# EasyEDA Pro project ax08_doc.eprj, schematic ax08 main, sheets 1 to 4 of 16

## Sheets
1 register file: Board Name: ax08 main; Create Date: 2025-09-11; Page Name: register file; Project Name: ax08_doc; Schematic Name: ax08 main; Update Date: 2025-10-05; Company: EasyEDA.com; Page Size: A4; Version: V1.0
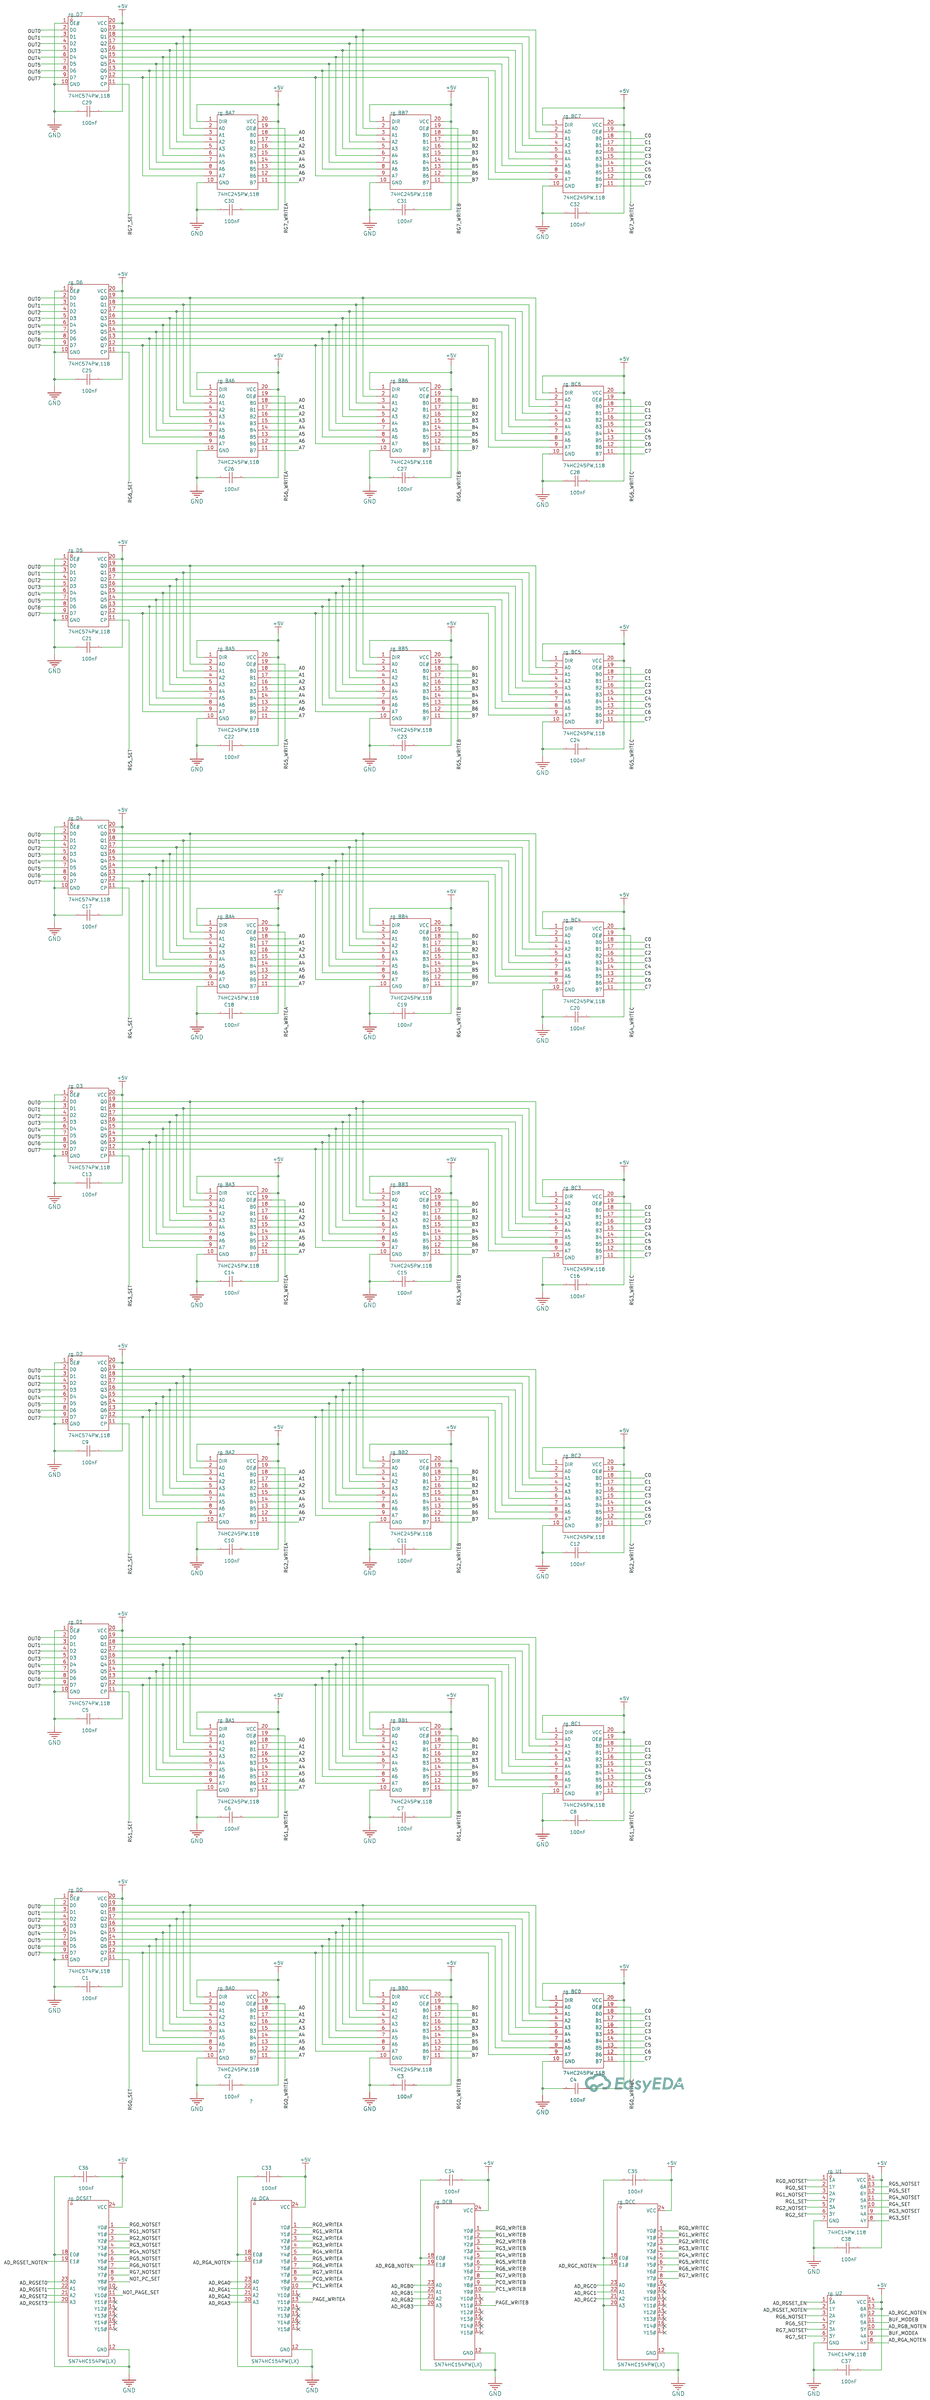
[diagram p5: register file]
2 program counter: Page Name: program counter; Update Date: 2025-09-11
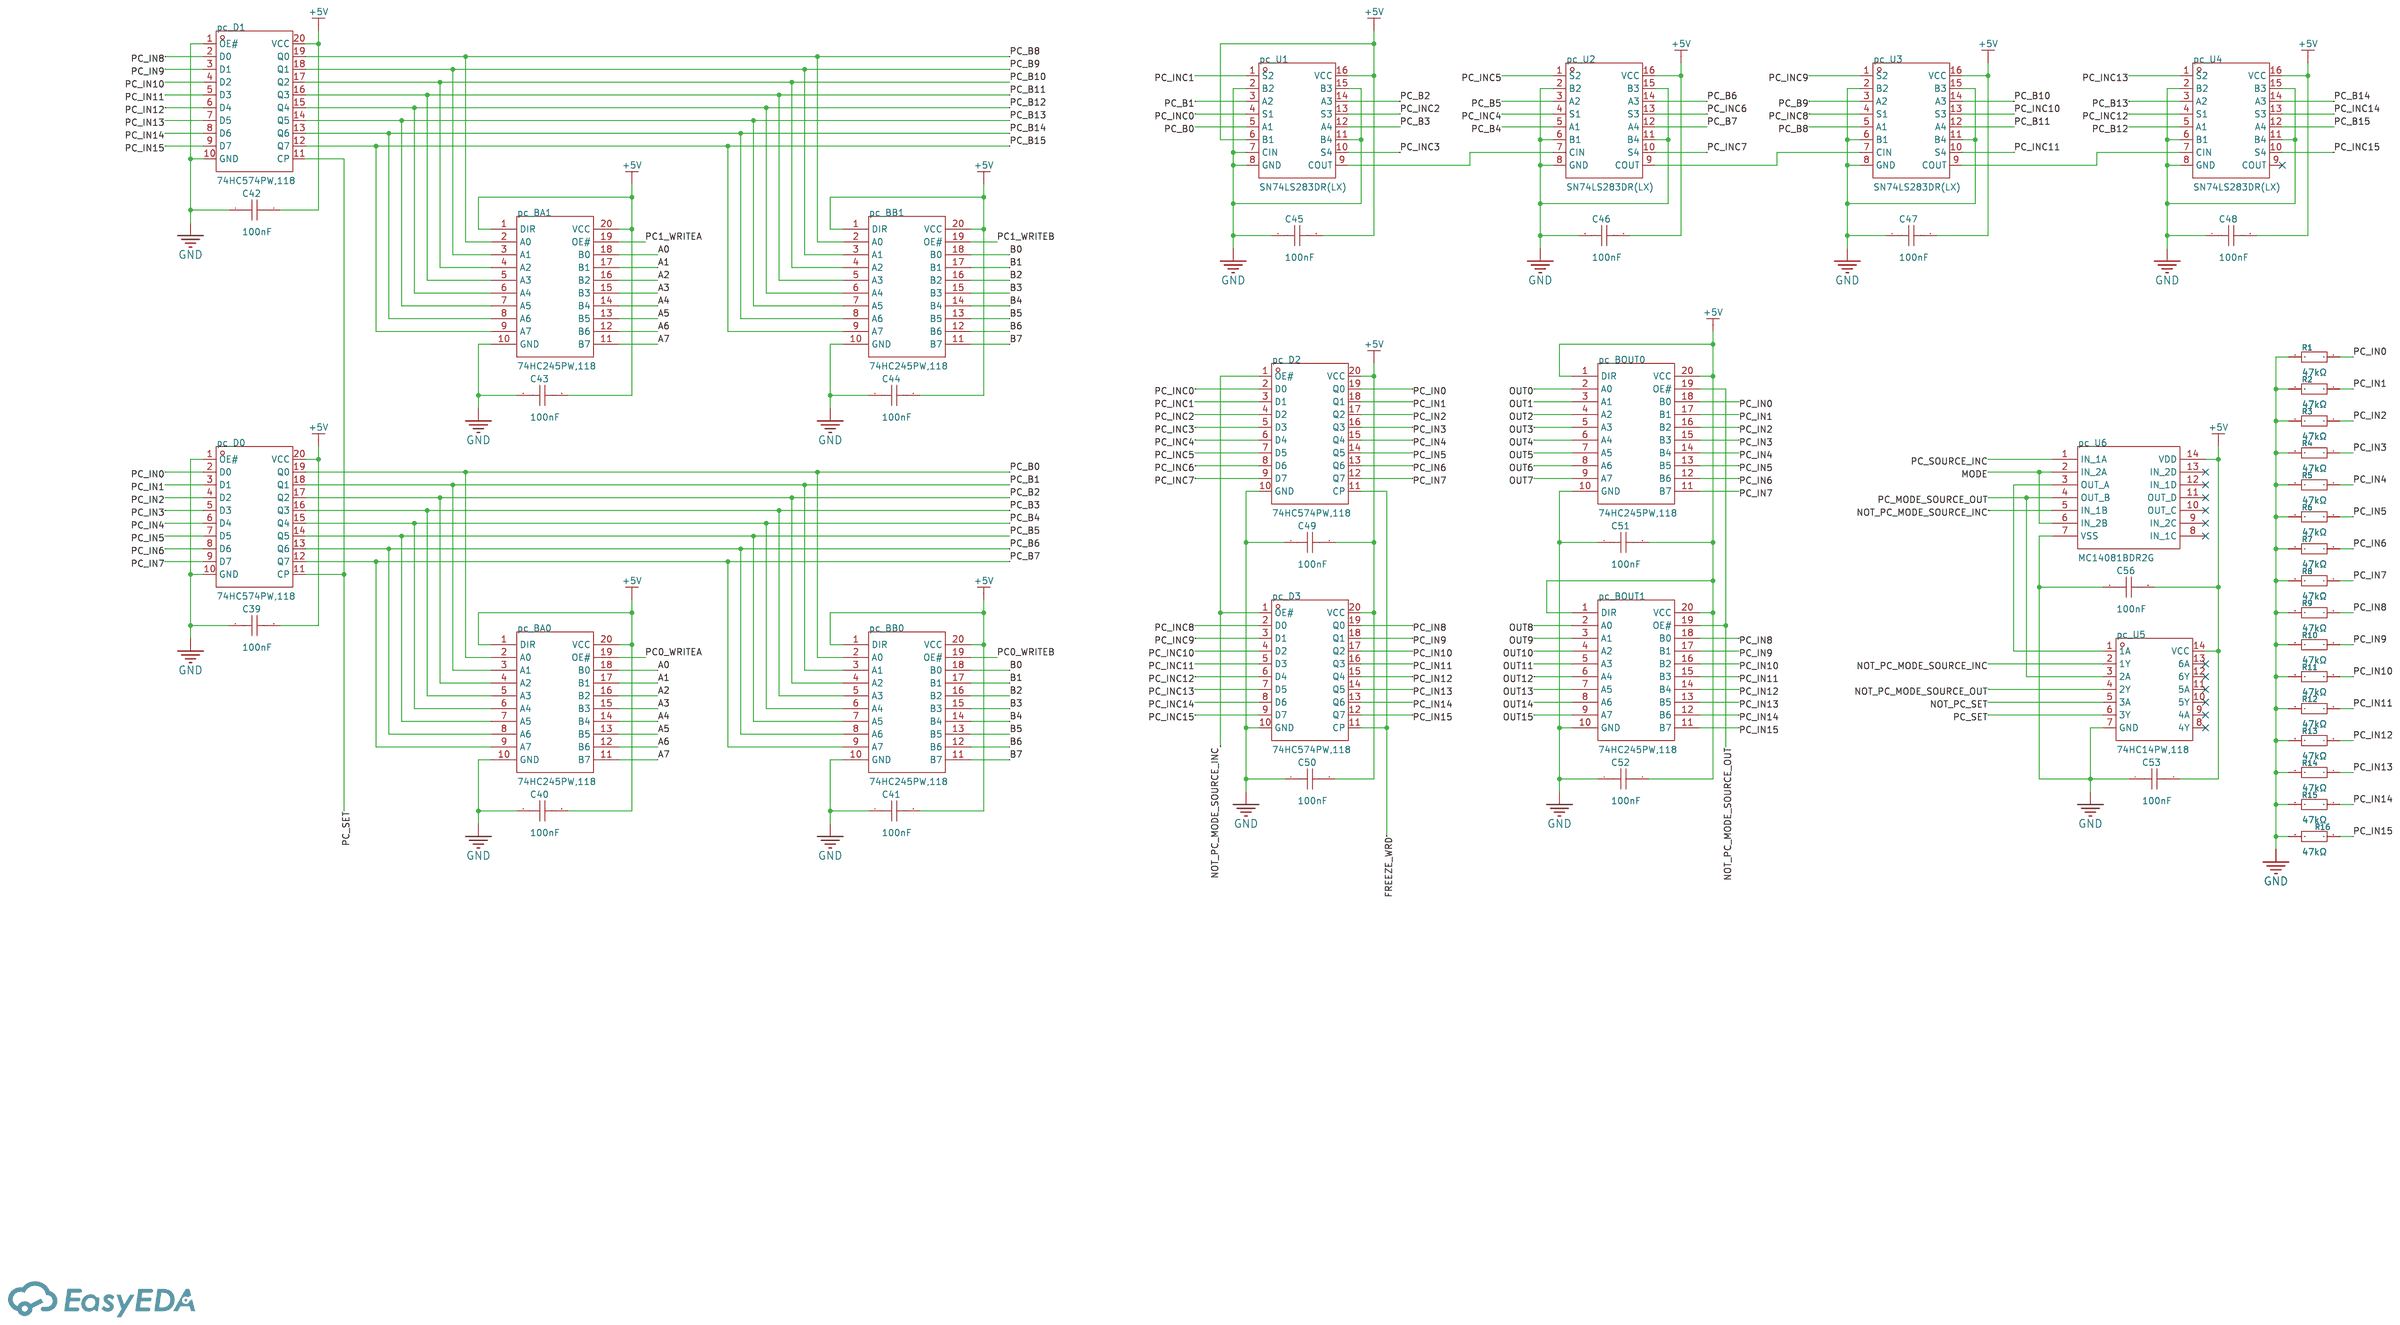
[diagram p6: program counter]
3 condition: Page Name: condition; Update Date: 2025-09-12
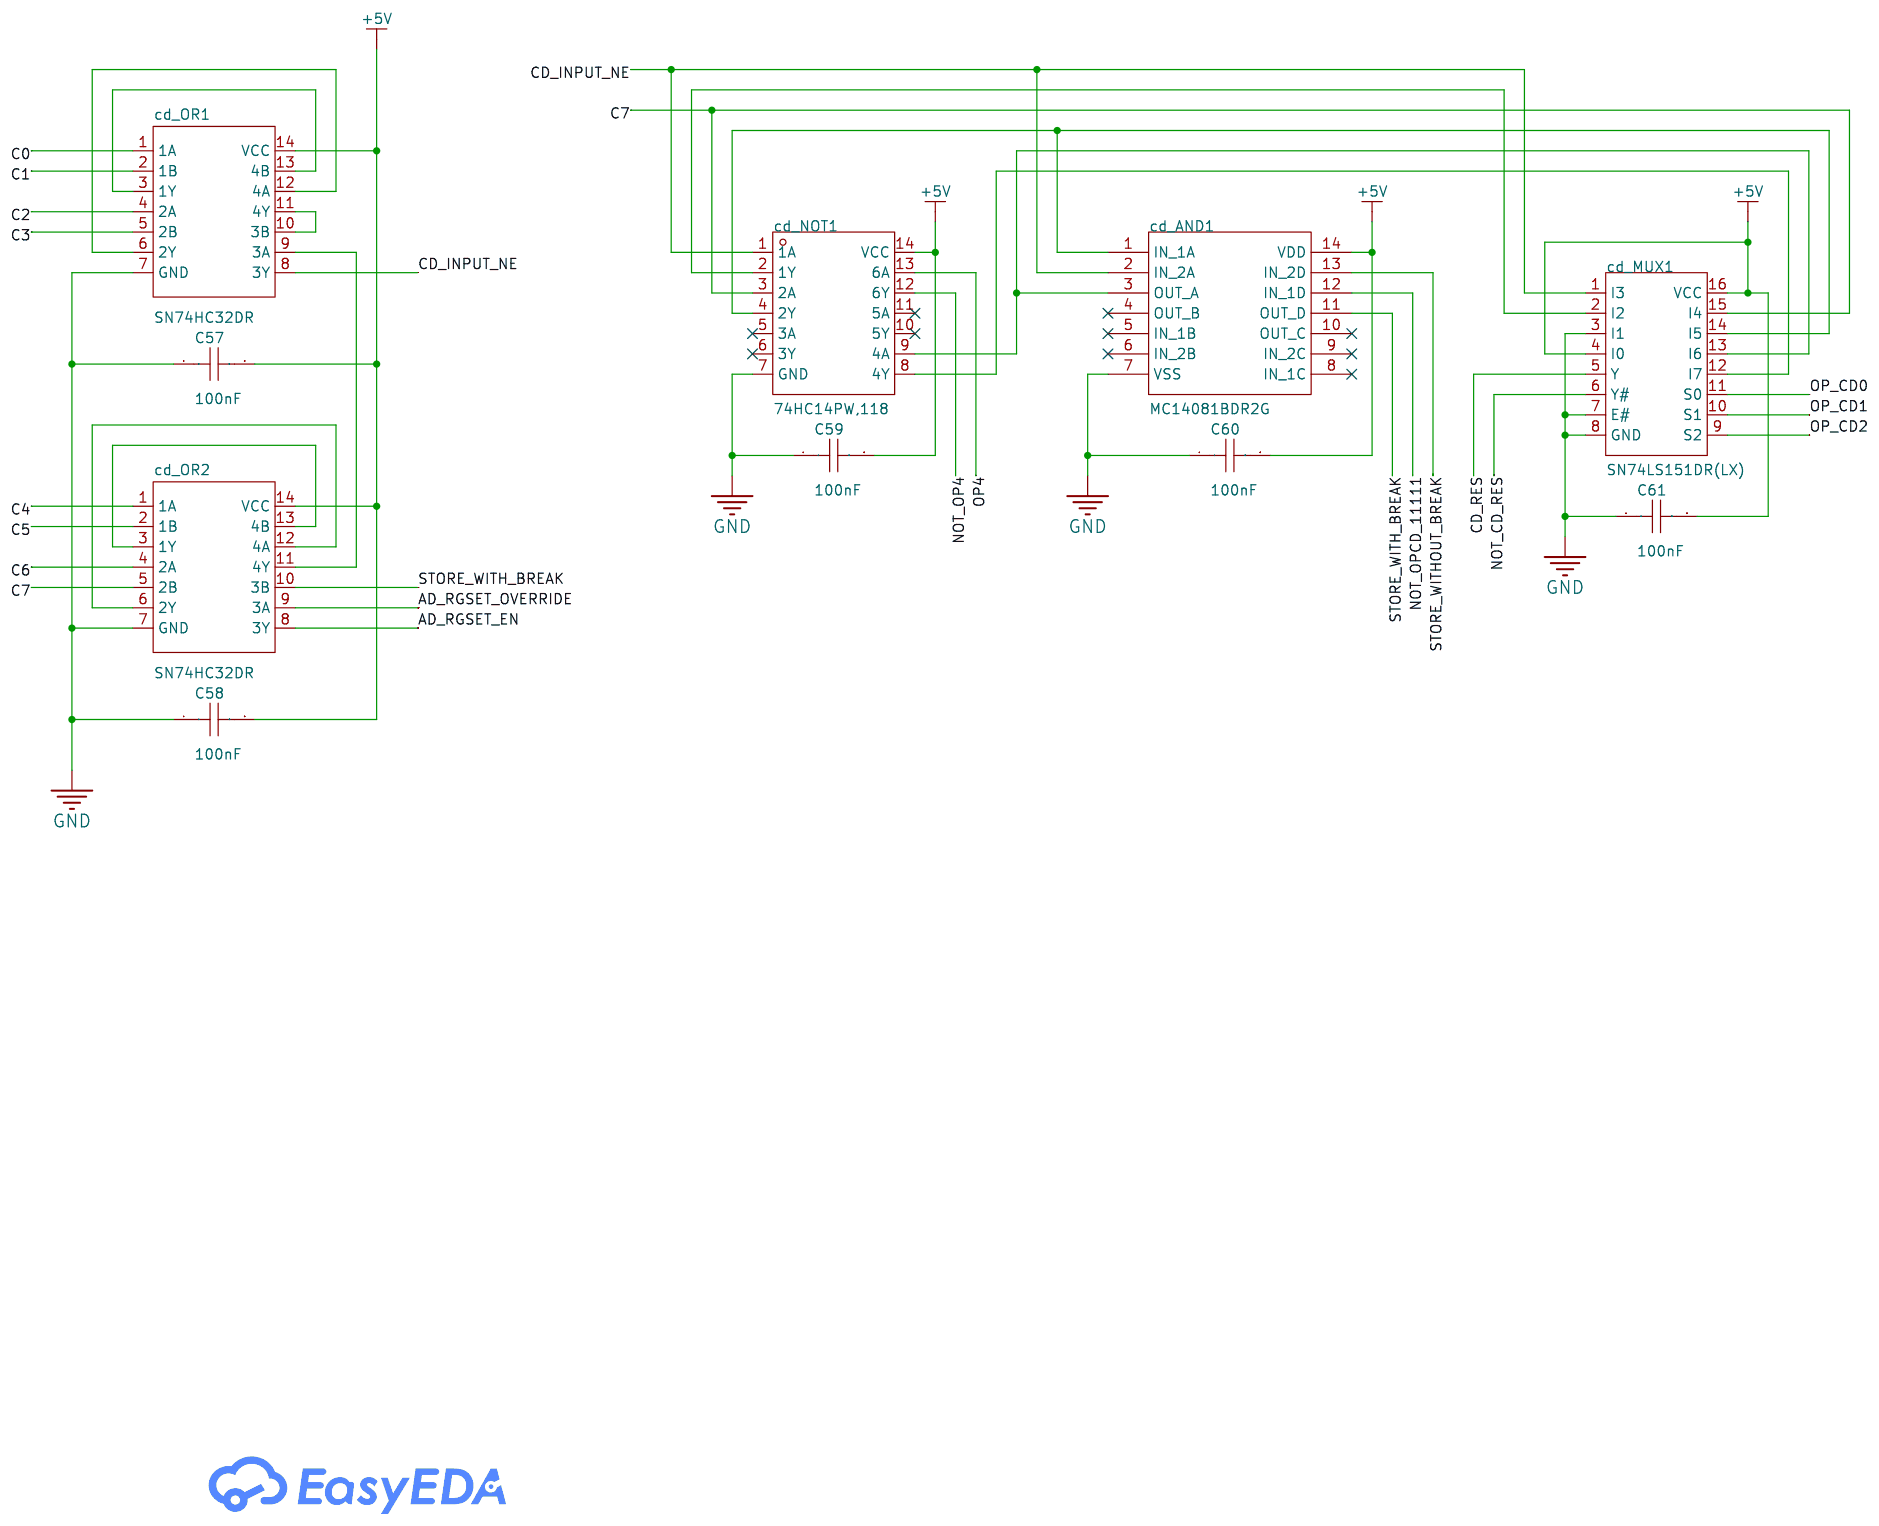
[diagram p7: condition]
4 page register: Page Name: page register; Update Date: 2025-09-11
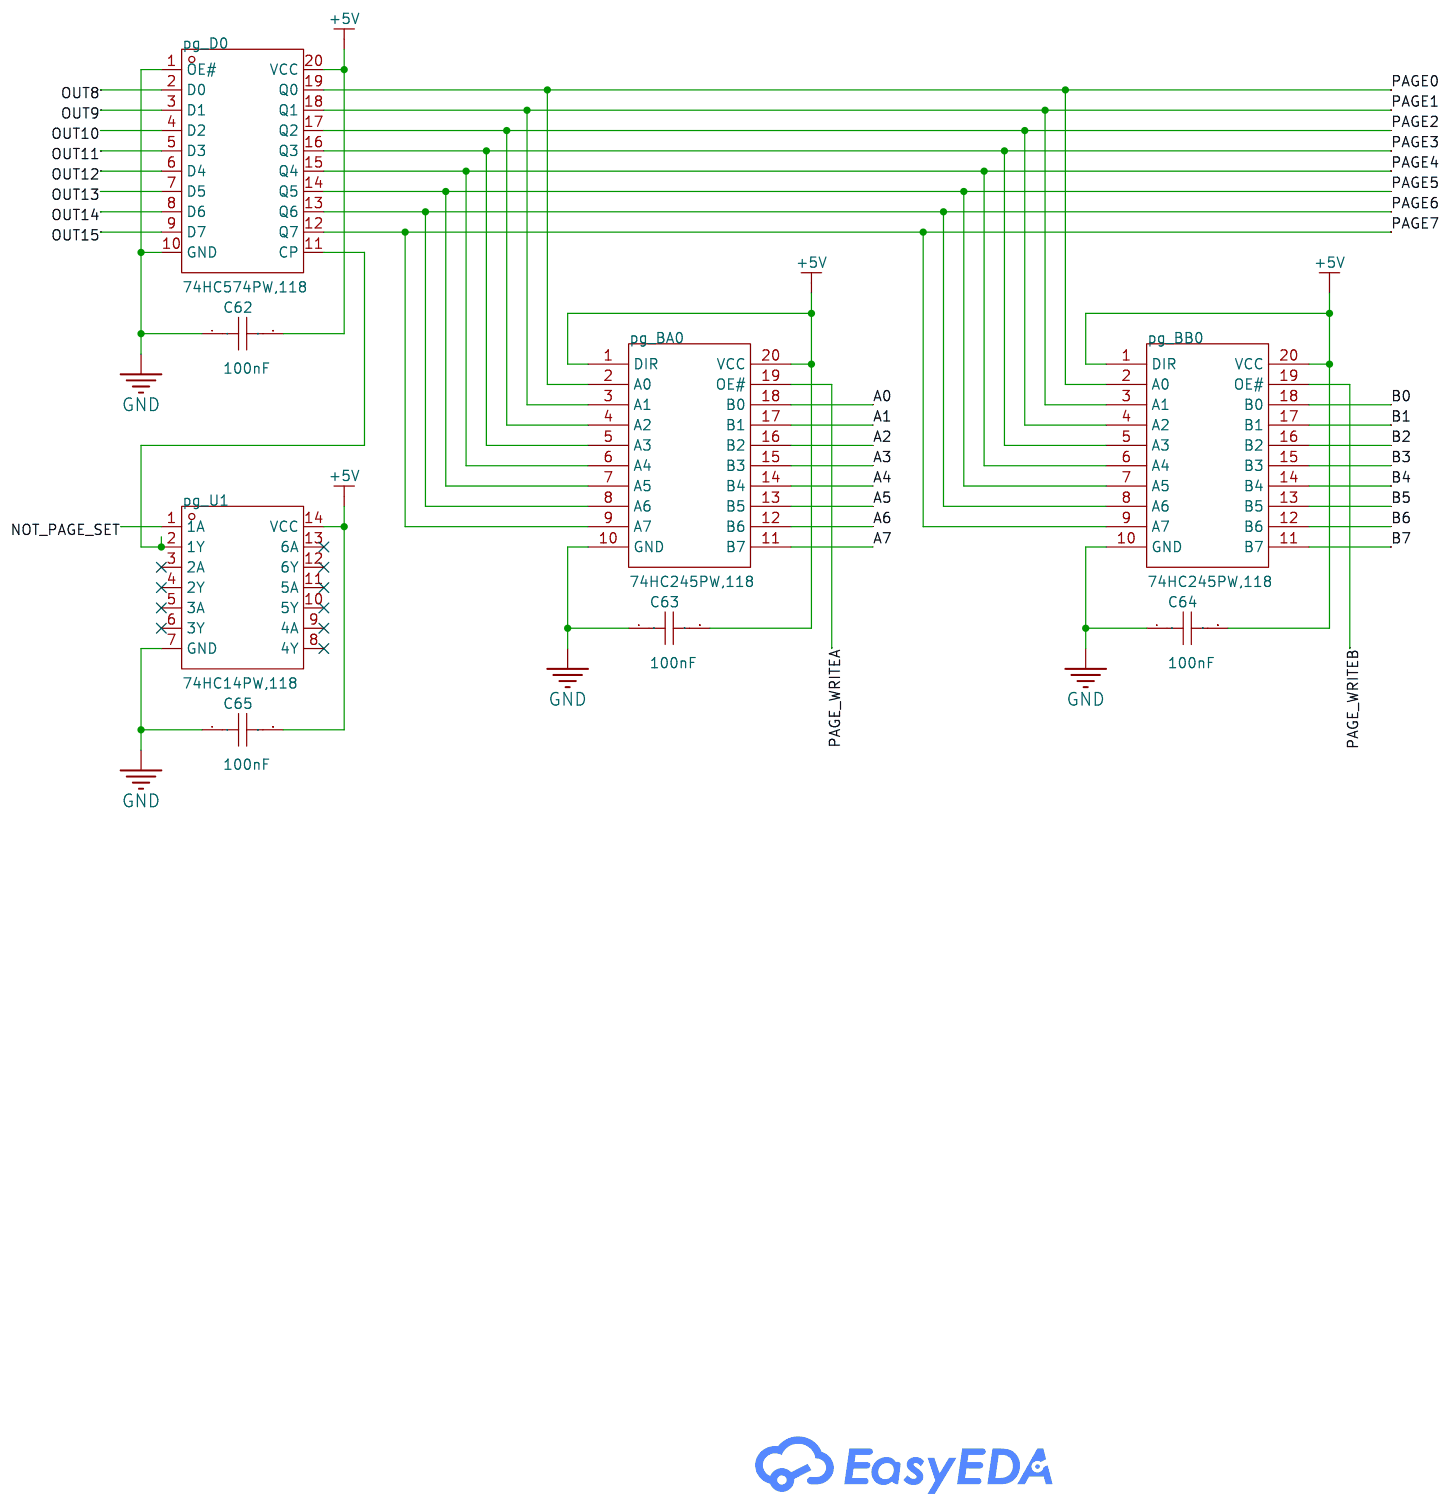
[diagram p8: page register]

## Parts
sheet condition
C57  100nF  [C0805]
C58  100nF  [C0805]
C59  100nF  [C0805]
C60  100nF  [C0805]
C61  100nF  [C0805]
cd_AND1  MC14081BDR2G  [SOIC-14_L8.7-W3.9-P1.27-LS6.0-BL]
cd_MUX1  SN74LS151DR(LX)  [SOP-16_L9.9-W3.9-P1.27-LS6.0-BL]
cd_NOT1  74HC14PW,118  [TSSOP-14_L5.0-W4.4-P0.65-LS6.4-BL]
cd_OR1  SN74HC32DR  [SOIC-14_L8.7-W3.9-P1.27-LS6.0-BL]
cd_OR2  SN74HC32DR  [SOIC-14_L8.7-W3.9-P1.27-LS6.0-BL]
sheet page register
C62  100nF  [C0805]
C63  100nF  [C0805]
C64  100nF  [C0805]
C65  100nF  [C0805]
pg_BA0  74HC245PW,118  [TSSOP-20_L6.5-W4.4-P0.65-LS6.4-BL]
pg_BB0  74HC245PW,118  [TSSOP-20_L6.5-W4.4-P0.65-LS6.4-BL]
pg_D0  74HC574PW,118  [TSSOP-20_L6.5-W4.4-P0.65-LS6.4-BL]
pg_U1  74HC14PW,118  [TSSOP-14_L5.0-W4.4-P0.65-LS6.4-BL]
sheet program counter
C39  100nF  [C0805]
C40  100nF  [C0805]
C41  100nF  [C0805]
C42  100nF  [C0805]
C43  100nF  [C0805]
C44  100nF  [C0805]
C45  100nF  [C0805]
C46  100nF  [C0805]
C47  100nF  [C0805]
C48  100nF  [C0805]
C49  100nF  [C0805]
C50  100nF  [C0805]
C51  100nF  [C0805]
C52  100nF  [C0805]
C53  100nF  [C0805]
C56  100nF  [C0805]
pc_BA0  74HC245PW,118  [TSSOP-20_L6.5-W4.4-P0.65-LS6.4-BL]
pc_BA1  74HC245PW,118  [TSSOP-20_L6.5-W4.4-P0.65-LS6.4-BL]
pc_BB0  74HC245PW,118  [TSSOP-20_L6.5-W4.4-P0.65-LS6.4-BL]
pc_BB1  74HC245PW,118  [TSSOP-20_L6.5-W4.4-P0.65-LS6.4-BL]
pc_BOUT0  74HC245PW,118  [TSSOP-20_L6.5-W4.4-P0.65-LS6.4-BL]
pc_BOUT1  74HC245PW,118  [TSSOP-20_L6.5-W4.4-P0.65-LS6.4-BL]
pc_D0  74HC574PW,118  [TSSOP-20_L6.5-W4.4-P0.65-LS6.4-BL]
pc_D1  74HC574PW,118  [TSSOP-20_L6.5-W4.4-P0.65-LS6.4-BL]
pc_D2  74HC574PW,118  [TSSOP-20_L6.5-W4.4-P0.65-LS6.4-BL]
pc_D3  74HC574PW,118  [TSSOP-20_L6.5-W4.4-P0.65-LS6.4-BL]
pc_U1  SN74LS283DR(LX)  [SOIC-16_L9.9-W3.9-P1.27-LS6.0-BL-1]
pc_U2  SN74LS283DR(LX)  [SOIC-16_L9.9-W3.9-P1.27-LS6.0-BL-1]
pc_U3  SN74LS283DR(LX)  [SOIC-16_L9.9-W3.9-P1.27-LS6.0-BL-1]
pc_U4  SN74LS283DR(LX)  [SOIC-16_L9.9-W3.9-P1.27-LS6.0-BL-1]
pc_U5  74HC14PW,118  [TSSOP-14_L5.0-W4.4-P0.65-LS6.4-BL]
pc_U6  MC14081BDR2G  [SOIC-14_L8.7-W3.9-P1.27-LS6.0-BL]
R1  47kΩ  [R0603]
R2  47kΩ  [R0603]
R3  47kΩ  [R0603]
R4  47kΩ  [R0603]
R5  47kΩ  [R0603]
R6  47kΩ  [R0603]
R7  47kΩ  [R0603]
R8  47kΩ  [R0603]
R9  47kΩ  [R0603]
R10  47kΩ  [R0603]
R11  47kΩ  [R0603]
R12  47kΩ  [R0603]
R13  47kΩ  [R0603]
R14  47kΩ  [R0603]
R15  47kΩ  [R0603]
R16  47kΩ  [R0603]
sheet register file
C1  100nF  [C0805]
C2  100nF  [C0805]
C3  100nF  [C0805]
C4  100nF  [C0805]
C5  100nF  [C0805]
C6  100nF  [C0805]
C7  100nF  [C0805]
C8  100nF  [C0805]
C9  100nF  [C0805]
C10  100nF  [C0805]
C11  100nF  [C0805]
C12  100nF  [C0805]
C13  100nF  [C0805]
C14  100nF  [C0805]
C15  100nF  [C0805]
C16  100nF  [C0805]
C17  100nF  [C0805]
C18  100nF  [C0805]
C19  100nF  [C0805]
C20  100nF  [C0805]
C21  100nF  [C0805]
C22  100nF  [C0805]
C23  100nF  [C0805]
C24  100nF  [C0805]
C25  100nF  [C0805]
C26  100nF  [C0805]
C27  100nF  [C0805]
C28  100nF  [C0805]
C29  100nF  [C0805]
C30  100nF  [C0805]
C31  100nF  [C0805]
C32  100nF  [C0805]
C33  100nF  [C0805]
C34  100nF  [C0805]
C35  100nF  [C0805]
C36  100nF  [C0805]
C37  100nF  [C0805]
C38  100nF  [C0805]
rg_BA0  74HC245PW,118  [TSSOP-20_L6.5-W4.4-P0.65-LS6.4-BL]
rg_BA1  74HC245PW,118  [TSSOP-20_L6.5-W4.4-P0.65-LS6.4-BL]
rg_BA2  74HC245PW,118  [TSSOP-20_L6.5-W4.4-P0.65-LS6.4-BL]
rg_BA3  74HC245PW,118  [TSSOP-20_L6.5-W4.4-P0.65-LS6.4-BL]
rg_BA4  74HC245PW,118  [TSSOP-20_L6.5-W4.4-P0.65-LS6.4-BL]
rg_BA5  74HC245PW,118  [TSSOP-20_L6.5-W4.4-P0.65-LS6.4-BL]
rg_BA6  74HC245PW,118  [TSSOP-20_L6.5-W4.4-P0.65-LS6.4-BL]
rg_BA7  74HC245PW,118  [TSSOP-20_L6.5-W4.4-P0.65-LS6.4-BL]
rg_BB0  74HC245PW,118  [TSSOP-20_L6.5-W4.4-P0.65-LS6.4-BL]
rg_BB1  74HC245PW,118  [TSSOP-20_L6.5-W4.4-P0.65-LS6.4-BL]
rg_BB2  74HC245PW,118  [TSSOP-20_L6.5-W4.4-P0.65-LS6.4-BL]
rg_BB3  74HC245PW,118  [TSSOP-20_L6.5-W4.4-P0.65-LS6.4-BL]
rg_BB4  74HC245PW,118  [TSSOP-20_L6.5-W4.4-P0.65-LS6.4-BL]
rg_BB5  74HC245PW,118  [TSSOP-20_L6.5-W4.4-P0.65-LS6.4-BL]
rg_BB6  74HC245PW,118  [TSSOP-20_L6.5-W4.4-P0.65-LS6.4-BL]
rg_BB7  74HC245PW,118  [TSSOP-20_L6.5-W4.4-P0.65-LS6.4-BL]
rg_BC0  74HC245PW,118  [TSSOP-20_L6.5-W4.4-P0.65-LS6.4-BL]
rg_BC1  74HC245PW,118  [TSSOP-20_L6.5-W4.4-P0.65-LS6.4-BL]
rg_BC2  74HC245PW,118  [TSSOP-20_L6.5-W4.4-P0.65-LS6.4-BL]
rg_BC3  74HC245PW,118  [TSSOP-20_L6.5-W4.4-P0.65-LS6.4-BL]
rg_BC4  74HC245PW,118  [TSSOP-20_L6.5-W4.4-P0.65-LS6.4-BL]
rg_BC5  74HC245PW,118  [TSSOP-20_L6.5-W4.4-P0.65-LS6.4-BL]
rg_BC6  74HC245PW,118  [TSSOP-20_L6.5-W4.4-P0.65-LS6.4-BL]
rg_BC7  74HC245PW,118  [TSSOP-20_L6.5-W4.4-P0.65-LS6.4-BL]
rg_D0  74HC574PW,118  [TSSOP-20_L6.5-W4.4-P0.65-LS6.4-BL]
rg_D1  74HC574PW,118  [TSSOP-20_L6.5-W4.4-P0.65-LS6.4-BL]
rg_D2  74HC574PW,118  [TSSOP-20_L6.5-W4.4-P0.65-LS6.4-BL]
rg_D3  74HC574PW,118  [TSSOP-20_L6.5-W4.4-P0.65-LS6.4-BL]
rg_D4  74HC574PW,118  [TSSOP-20_L6.5-W4.4-P0.65-LS6.4-BL]
rg_D5  74HC574PW,118  [TSSOP-20_L6.5-W4.4-P0.65-LS6.4-BL]
rg_D6  74HC574PW,118  [TSSOP-20_L6.5-W4.4-P0.65-LS6.4-BL]
rg_D7  74HC574PW,118  [TSSOP-20_L6.5-W4.4-P0.65-LS6.4-BL]
rg_DCA  SN74HC154PW(LX)  [TSSOP-24_L7.8-W4.4-P0.65-LS6.4-BL_1]
rg_DCB  SN74HC154PW(LX)  [TSSOP-24_L7.8-W4.4-P0.65-LS6.4-BL_1]
rg_DCC  SN74HC154PW(LX)  [TSSOP-24_L7.8-W4.4-P0.65-LS6.4-BL_1]
rg_DCSET  SN74HC154PW(LX)  [TSSOP-24_L7.8-W4.4-P0.65-LS6.4-BL_1]
rg_U1  74HC14PW,118  [TSSOP-14_L5.0-W4.4-P0.65-LS6.4-BL]
rg_U2  74HC14PW,118  [TSSOP-14_L5.0-W4.4-P0.65-LS6.4-BL]

## Library data of the parts
C57-C61 = CC0805KRX7R9BB104: LCSC Part Name: 100nF ±10% 50V; Supplier Part: C49678; Manufacturer: YAGEO(国巨); Supplier Footprint: 0805; JLCPCB Part Class: Basic Part; Datasheet: https://atta.szlcsc.com/upload/public/pdf/source/20180224/C181747_15194369449651363981.pdf; Supplier: LCSC; Tolerance: ±10%
cd_AND1 pc_U6 = MC14081BDR2G: Supplier Part: C52342; Manufacturer: onsemi(安森美); Supplier Footprint: SOIC-14; JLCPCB Part Class: Extended Part; Datasheet: https://atta.szlcsc.com/upload/public/pdf/source/20191203/C463300_6D19168778DBD465A86B239F140F6B23.pdf; Supplier: LCSC; Logic Gate Type: With Door; Number of Channels: 4; Supply Voltage: 3V~18V; Quiescent Current (Max): 1uA; Sink Current: 8.8mA; Source Current: 8.8mA; High Level Range (VIH): 3.5V~11V; Low Level Range (VIL): 1.5V~4V; Series: 4000BSeries; Propagation Delay Time: 100ns@15V,50pF; Operating Temperature: -55℃~+125℃
cd_MUX1 = SN74LS151DR(LX): LCSC Part Name: 集成电路; Supplier Part: C22384799; Manufacturer: LX(灵星芯微); Supplier Footprint: SOP-16; JLCPCB Part Class: Extended Part; Datasheet: https://atta.szlcsc.com/upload/public/pdf/source/20240417/7DDD5D0D7F70EA99A3E738629D06B469.pdf; Supplier: LCSC; Type: Multiplexers; Voltage Supply Source: Single supply; Voltage - Supply: 2V~6V; Current - Output Low(IOL): 5.2mA; Current - Output High(IOH): 5.2mA; Operating temperature: -40℃~+125℃
cd_NOT1 pc_U5 pg_U1 rg_U1 rg_U2 = 74HC14PW,118: Input Type:Schmitt Trigger Supply Voltage(Single):2V~6V Supply Voltage(Single):2V~6V Supply Current (Max):2uA Number of Circuits:6 Number of Inputs:1 Sink Current:5.2mA Source Current:5.2mA High level range (VIH):1.5V~4.2V High level range (VIH):1.5V~4.2V; LCSC Part Name: 六路施密特触发反相器; Supplier Part: C5606; Manufacturer: Nexperia(安世); Supplier Footprint: TSSOP-14; JLCPCB Part Class: Extended Part; Datasheet: https://atta.szlcsc.com/upload/public/pdf/source/20170918/C131315_1505726904049976307.pdf; Supplier: LCSC; Input Type: Schmitt Trigger; Supply Voltage(Single): 2V~6V; Supply Current (Max): 2uA; Number of Circuits: 6; Number of Inputs: 1; Sink Current: 5.2mA; Source Current: 5.2mA; High level range (VIH): 1.5V~4.2V; Low level range (VIL): 300mV~1.2V; Max Propagation Delay: 21ns@6V,50pF; Series: 74HCSeries; Operating Temperature: -40℃~+125℃
cd_OR1 cd_OR2 = SN74HC32DR: Supplier Part: C6838; Manufacturer: TI(德州仪器); Supplier Footprint: SOIC-14; JLCPCB Part Class: Extended Part; Datasheet: https://www.ti.com/cn/lit/gpn/sn74hc32; Supplier: LCSC; Logic Type: OR Gate; Number of Channels: 4; Voltage - Supply: 2V~6V; Quiescent Current: 2uA; Current - Output Low(IOL): 5.2mA; Current - Output High(IOH): 5.2mA; Input Logic Level - High: 1.5V~4.2V; Input Logic Level - Low: 500mV~1.8V; Series: 74HCSeries; Propagation Delay: 17ns@6V,50pF; Operating Temperature: -40℃~+85℃
C1-C53 C56 C62-C65 = CC0805KRX7R9BB104: Capacitance: Tolerance:±10% Tolerance:±10% Voltage Rated: Temperature Coefficient:; LCSC Part Name: 100nF ±10% 50V; Supplier Part: C49678; Manufacturer: YAGEO(国巨); Supplier Footprint: 0805; JLCPCB Part Class: Basic Part; Datasheet: https://atta.szlcsc.com/upload/public/pdf/source/20180224/C181747_15194369449651363981.pdf; Supplier: LCSC; Tolerance: ±10%
pc_BA0 pc_BA1 pc_BB0 pc_BB1 pc_BOUT0 pc_BOUT1 pg_BA0 pg_BB0 rg_BA0-rg_BA7 rg_BB0-rg_BB7 rg_BC0-rg_BC7 = 74HC245PW,118: Input type:- output type:Tri-State Supply Voltage:2V~6V Supply Voltage:2V~6V Number of Elements:1 Number of Bits per Element:8 Channel Type:- Sink Current:7.8mA Source Current:7.8mA Logic Family:74HC Operating Temperature:-40℃~+125℃ Operating Temperature:; Supplier Part: C5626; Manufacturer: Nexperia(安世); Supplier Footprint: TSSOP-20; JLCPCB Part Class: Extended Part; Datasheet: https://atta.szlcsc.com/upload/public/pdf/source/20240724/EDC8C45902BA97AEC59E8811E3964917.pdf; Supplier: LCSC; output type: Tri-State; Supply Voltage: 2V~6V; Number of Elements: 1; Number of Bits per Element: 8; Sink Current: 7.8mA; Source Current: 7.8mA; Logic Family: 74HC; Operating Temperature: -40℃~+125℃
pc_D0-pc_D3 pg_D0 rg_D0-rg_D7 = 74HC574PW,118: Type:D-Type Trigger Type:Rising Edge Supply Voltage:2V~6V Supply Voltage:2V~6V Clock Frequency:133MHz Function: Number of Elements:1 Number of Bits per Element:8 Output Type: Maximum Propagation Delay:26ns@6V,50pF Series:74HCSeries Sink Current:7.8mA Sour; Supplier Part: C93762; Manufacturer: Nexperia(安世); Supplier Footprint: TSSOP-20; JLCPCB Part Class: Extended Part; Datasheet: https://atta.szlcsc.com/upload/public/pdf/source/20230809/78F4E93A48B1813E6DF94573D4B43A3E.pdf; Supplier: LCSC; Type: D-Type; Trigger Type: Rising Edge; Supply Voltage: 2V~6V; Clock Frequency: 133MHz; Number of Elements: 1; Number of Bits per Element: 8; Maximum Propagation Delay: 26ns@6V,50pF; Series: 74HCSeries; Sink Current: 7.8mA; Source Current: 7.8mA; Quiescent Current (Iq): 8uA; Input Capacitance: 3.5pF; Operating Temperature: -40℃~+125℃
pc_U1-pc_U4 = SN74LS283DR(LX): Supplier Part: C22374103; Manufacturer: LX(灵星芯微); Supplier Footprint: SOP-16; JLCPCB Part Class: Extended Part; Datasheet: https://atta.szlcsc.com/upload/public/pdf/source/20240402/80BBEEF0EDCF1C8215BAA06339FE4235.pdf; Supplier: LCSC; Logic Type: Binary Full Adder; Number of Channels: 4; Supply Voltage: 2V~6V; Operating Temperature: -40℃~+125℃
R1-R16 = FRC0603F4702TS: Type:Thick Film Resistors Resistance:47kΩ Tolerance:±1% Tolerance:±1% Power(Watts): Overload Voltage (Max): Temperature Coefficient:±100ppm/℃ Temperature Coefficient:±100ppm/℃ Operating Temperature Range:-55℃~+155℃ Operating Temperature Range:-55℃~+155℃; LCSC Part Name: 47kΩ ±1% 100mW 厚膜电阻; Supplier Part: C2907042; Manufacturer: FOJAN(富捷); Supplier Footprint: 0603; JLCPCB Part Class: Extended Part; Datasheet: https://atta.szlcsc.com/upload/public/pdf/source/20211221/925EC7D7225764EE0046F22065062C87.pdf; Supplier: LCSC; Type: Thick Film Resistors; Tolerance: ±1%; Temperature Coefficient: ±100ppm/℃; Operating Temperature Range: -55℃~+155℃
rg_DCA rg_DCB rg_DCC rg_DCSET = SN74HC154PW(LX): Type:Decoder/Demultiplexers Voltage Supply Source:Single supply Supply Voltage:2V~6V Supply Voltage:2V~6V Number of lines:4~16 Number of lines:4~16 Sink Current:- Source Current:- Operating temperature:-40℃~+125℃ Operating temperature:-40℃~+125℃; Supplier Part: C41413100; Manufacturer: LX(灵星芯微); Supplier Footprint: TSSOP-24; JLCPCB Part Class: Extended Part; Datasheet: https://atta.szlcsc.com/upload/public/pdf/source/20240923/0BF8EBFBC2EE7843BBF2E86797CF806E.pdf; Supplier: LCSC; Type: Decoder/Demultiplexers; Voltage Supply Source: Single supply; Supply Voltage: 2V~6V; Number of lines: 4~16; Operating temperature: -40℃~+125℃

## Nets
+5V: C1.2 C2.2 C3.2 C4.2 C5.2 C6.2 C7.2 C8.2 C9.2 C10.2 C11.2 C12.2 C13.2 C14.2 C15.2 C16.2 C17.2 C18.2 C19.2 C20.2 C21.2 C22.2 C23.2 C24.2 C25.2 C26.2 C27.2 C28.2 C29.2 C30.2 C31.2 C32.2 C33.1 C34.1 C35.1 C36.1 C37.2 C38.2 C39.2 C40.2 C41.2 C42.2 C43.2 C44.2 C45.2 C46.2 C47.2 C48.2 C49.2 C50.2 C51.2 C52.2 C53.2 C56.2 C57.2 C58.2 C59.2 C60.2 C61.2 C62.2 C63.2 C64.2 C65.2 cd_AND1.14(VDD) cd_MUX1.4(I0) cd_MUX1.16(VCC) cd_NOT1.14(VCC) cd_OR1.14(VCC) cd_OR2.14(VCC) pc_BA0.1(DIR) pc_BA0.20(VCC) pc_BA1.1(DIR) pc_BA1.20(VCC) pc_BB0.1(DIR) pc_BB0.20(VCC) pc_BB1.1(DIR) pc_BB1.20(VCC) pc_BOUT0.1(DIR) pc_BOUT0.20(VCC) pc_BOUT1.1(DIR) pc_BOUT1.20(VCC) pc_D0.20(VCC) pc_D1.20(VCC) pc_D2.20(VCC) pc_D3.20(VCC) pc_U1.6(B1) pc_U1.16(VCC) pc_U2.16(VCC) pc_U3.16(VCC) pc_U4.16(VCC) pc_U5.14(VCC) pc_U6.14(VDD) pg_BA0.1(DIR) pg_BA0.20(VCC) pg_BB0.1(DIR) pg_BB0.20(VCC) pg_D0.20(VCC) pg_U1.14(VCC) rg_BA0.1(DIR) rg_BA0.20(VCC) rg_BA1.1(DIR) rg_BA1.20(VCC) rg_BA2.1(DIR) rg_BA2.20(VCC) rg_BA3.1(DIR) rg_BA3.20(VCC) rg_BA4.1(DIR) rg_BA4.20(VCC) rg_BA5.1(DIR) rg_BA5.20(VCC) rg_BA6.1(DIR) rg_BA6.20(VCC) rg_BA7.1(DIR) rg_BA7.20(VCC) rg_BB0.1(DIR) rg_BB0.20(VCC) rg_BB1.1(DIR) rg_BB1.20(VCC) rg_BB2.1(DIR) rg_BB2.20(VCC) rg_BB3.1(DIR) rg_BB3.20(VCC) rg_BB4.1(DIR) rg_BB4.20(VCC) rg_BB5.1(DIR) rg_BB5.20(VCC) rg_BB6.1(DIR) rg_BB6.20(VCC) rg_BB7.1(DIR) rg_BB7.20(VCC) rg_BC0.1(DIR) rg_BC0.20(VCC) rg_BC1.1(DIR) rg_BC1.20(VCC) rg_BC2.1(DIR) rg_BC2.20(VCC) rg_BC3.1(DIR) rg_BC3.20(VCC) rg_BC4.1(DIR) rg_BC4.20(VCC) rg_BC5.1(DIR) rg_BC5.20(VCC) rg_BC6.1(DIR) rg_BC6.20(VCC) rg_BC7.1(DIR) rg_BC7.20(VCC) rg_D0.20(VCC) rg_D1.20(VCC) rg_D2.20(VCC) rg_D3.20(VCC) rg_D4.20(VCC) rg_D5.20(VCC) rg_D6.20(VCC) rg_D7.20(VCC) rg_DCA.24(VCC) rg_DCB.24(VCC) rg_DCC.24(VCC) rg_DCSET.24(VCC) rg_U1.14(VCC) rg_U2.13(6A) rg_U2.14(VCC) ; also on sheet 5 6 7 8 9 10 11 12 13 14 15 16
GND: C1.1 C2.1 C3.1 C4.1 C5.1 C6.1 C7.1 C8.1 C9.1 C10.1 C11.1 C12.1 C13.1 C14.1 C15.1 C16.1 C17.1 C18.1 C19.1 C20.1 C21.1 C22.1 C23.1 C24.1 C25.1 C26.1 C27.1 C28.1 C29.1 C30.1 C31.1 C32.1 C33.2 C34.2 C35.2 C36.2 C37.1 C38.1 C39.1 C40.1 C41.1 C42.1 C43.1 C44.1 C45.1 C46.1 C47.1 C48.1 C49.1 C50.1 C51.1 C52.1 C53.1 C56.1 C57.1 C58.1 C59.1 C60.1 C61.1 C62.1 C63.1 C64.1 C65.1 cd_AND1.7(VSS) cd_MUX1.3(I1) cd_MUX1.7(E#) cd_MUX1.8(GND) cd_NOT1.7(GND) cd_OR1.7(GND) cd_OR2.7(GND) pc_BA0.10(GND) pc_BA1.10(GND) pc_BB0.10(GND) pc_BB1.10(GND) pc_BOUT0.10(GND) pc_BOUT1.10(GND) pc_D0.1(OE#) pc_D0.10(GND) pc_D1.1(OE#) pc_D1.10(GND) pc_D2.10(GND) pc_D3.10(GND) pc_U1.2(B2) pc_U1.7(CIN) pc_U1.8(GND) pc_U1.11(B4) pc_U1.15(B3) pc_U2.2(B2) pc_U2.6(B1) pc_U2.8(GND) pc_U2.11(B4) pc_U2.15(B3) pc_U3.2(B2) pc_U3.6(B1) pc_U3.8(GND) pc_U3.11(B4) pc_U3.15(B3) pc_U4.2(B2) pc_U4.6(B1) pc_U4.8(GND) pc_U4.11(B4) pc_U4.15(B3) pc_U5.7(GND) pc_U6.7(VSS) pg_BA0.10(GND) pg_BB0.10(GND) pg_D0.1(OE#) pg_D0.10(GND) pg_U1.7(GND) R1.2 R2.2 R3.2 R4.2 R5.2 R6.2 R7.2 R8.2 R9.2 R10.2 R11.2 R12.2 R13.2 R14.2 R15.2 R16.2 rg_BA0.10(GND) rg_BA1.10(GND) rg_BA2.10(GND) rg_BA3.10(GND) rg_BA4.10(GND) rg_BA5.10(GND) rg_BA6.10(GND) rg_BA7.10(GND) rg_BB0.10(GND) rg_BB1.10(GND) rg_BB2.10(GND) rg_BB3.10(GND) rg_BB4.10(GND) rg_BB5.10(GND) rg_BB6.10(GND) rg_BB7.10(GND) rg_BC0.10(GND) rg_BC1.10(GND) rg_BC2.10(GND) rg_BC3.10(GND) rg_BC4.10(GND) rg_BC5.10(GND) rg_BC6.10(GND) rg_BC7.10(GND) rg_D0.1(OE#) rg_D0.10(GND) rg_D1.1(OE#) rg_D1.10(GND) rg_D2.1(OE#) rg_D2.10(GND) rg_D3.1(OE#) rg_D3.10(GND) rg_D4.1(OE#) rg_D4.10(GND) rg_D5.1(OE#) rg_D5.10(GND) rg_D6.1(OE#) rg_D6.10(GND) rg_D7.1(OE#) rg_D7.10(GND) rg_DCA.12(GND) rg_DCA.18(E0#) rg_DCB.12(GND) rg_DCB.18(E0#) rg_DCC.12(GND) rg_DCC.18(E0#) rg_DCC.20(A3) rg_DCSET.12(GND) rg_DCSET.18(E0#) rg_U1.7(GND) rg_U2.7(GND) ; also on sheet 5 6 7 8 9 10 11 12 13 14 15 16
A0: pc_BA0.18(B0) pc_BA1.18(B0) pg_BA0.18(B0) rg_BA0.18(B0) rg_BA1.18(B0) rg_BA2.18(B0) rg_BA3.18(B0) rg_BA4.18(B0) rg_BA5.18(B0) rg_BA6.18(B0) rg_BA7.18(B0) ; also on sheet 5 10 11 12 13 14
A1: pc_BA0.17(B1) pc_BA1.17(B1) pg_BA0.17(B1) rg_BA0.17(B1) rg_BA1.17(B1) rg_BA2.17(B1) rg_BA3.17(B1) rg_BA4.17(B1) rg_BA5.17(B1) rg_BA6.17(B1) rg_BA7.17(B1) ; also on sheet 5 10 11 12 13 14
A2: pc_BA0.16(B2) pc_BA1.16(B2) pg_BA0.16(B2) rg_BA0.16(B2) rg_BA1.16(B2) rg_BA2.16(B2) rg_BA3.16(B2) rg_BA4.16(B2) rg_BA5.16(B2) rg_BA6.16(B2) rg_BA7.16(B2) ; also on sheet 5 10 11 12 13 14
A3: pc_BA0.15(B3) pc_BA1.15(B3) pg_BA0.15(B3) rg_BA0.15(B3) rg_BA1.15(B3) rg_BA2.15(B3) rg_BA3.15(B3) rg_BA4.15(B3) rg_BA5.15(B3) rg_BA6.15(B3) rg_BA7.15(B3) ; also on sheet 5 10 11 13 14
A4: pc_BA0.14(B4) pc_BA1.14(B4) pg_BA0.14(B4) rg_BA0.14(B4) rg_BA1.14(B4) rg_BA2.14(B4) rg_BA3.14(B4) rg_BA4.14(B4) rg_BA5.14(B4) rg_BA6.14(B4) rg_BA7.14(B4) ; also on sheet 5 10 11 13 14
A5: pc_BA0.13(B5) pc_BA1.13(B5) pg_BA0.13(B5) rg_BA0.13(B5) rg_BA1.13(B5) rg_BA2.13(B5) rg_BA3.13(B5) rg_BA4.13(B5) rg_BA5.13(B5) rg_BA6.13(B5) rg_BA7.13(B5) ; also on sheet 5 10 11 13 14
A6: pc_BA0.12(B6) pc_BA1.12(B6) pg_BA0.12(B6) rg_BA0.12(B6) rg_BA1.12(B6) rg_BA2.12(B6) rg_BA3.12(B6) rg_BA4.12(B6) rg_BA5.12(B6) rg_BA6.12(B6) rg_BA7.12(B6) ; also on sheet 5 10 11 13 14
A7: pc_BA0.11(B7) pc_BA1.11(B7) pg_BA0.11(B7) rg_BA0.11(B7) rg_BA1.11(B7) rg_BA2.11(B7) rg_BA3.11(B7) rg_BA4.11(B7) rg_BA5.11(B7) rg_BA6.11(B7) rg_BA7.11(B7) ; also on sheet 5 10 11 13 14
AD_RGA0: rg_DCA.23(A0) ; also on sheet 5
AD_RGA1: rg_DCA.22(A1) ; also on sheet 5
AD_RGA2: rg_DCA.21(A2) ; also on sheet 5
AD_RGA3: rg_DCA.20(A3) ; also on sheet 5
AD_RGA_NOTEN: rg_DCA.19(E1#) rg_U2.8(4Y)
AD_RGB0: rg_DCB.23(A0) ; also on sheet 5
AD_RGB1: rg_DCB.22(A1) ; also on sheet 5
AD_RGB2: rg_DCB.21(A2) ; also on sheet 5
AD_RGB3: rg_DCB.20(A3) ; also on sheet 5
AD_RGB_NOTEN: rg_DCB.19(E1#) rg_U2.10(5Y)
AD_RGC0: rg_DCC.23(A0) ; also on sheet 5
AD_RGC1: rg_DCC.22(A1) ; also on sheet 5
AD_RGC2: rg_DCC.21(A2) ; also on sheet 5
AD_RGC_NOTEN: rg_DCC.19(E1#) rg_U2.12(6Y)
AD_RGSET0: rg_DCSET.23(A0) ; also on sheet 5
AD_RGSET1: rg_DCSET.22(A1) ; also on sheet 5
AD_RGSET2: rg_DCSET.21(A2) ; also on sheet 5
AD_RGSET3: rg_DCSET.20(A3) ; also on sheet 5
AD_RGSET_EN: cd_OR2.8(3Y) rg_U2.1(1A)
AD_RGSET_NOTEN: rg_DCSET.19(E1#) rg_U2.2(1Y)
AD_RGSET_OVERRIDE: cd_OR2.9(3A) ; also on sheet 8 16
B0: pc_BB0.18(B0) pc_BB1.18(B0) pg_BB0.18(B0) rg_BB0.18(B0) rg_BB1.18(B0) rg_BB2.18(B0) rg_BB3.18(B0) rg_BB4.18(B0) rg_BB5.18(B0) rg_BB6.18(B0) rg_BB7.18(B0) ; also on sheet 5 11 13 14
B1: pc_BB0.17(B1) pc_BB1.17(B1) pg_BB0.17(B1) rg_BB0.17(B1) rg_BB1.17(B1) rg_BB2.17(B1) rg_BB3.17(B1) rg_BB4.17(B1) rg_BB5.17(B1) rg_BB6.17(B1) rg_BB7.17(B1) ; also on sheet 5 11 13 14
B2: pc_BB0.16(B2) pc_BB1.16(B2) pg_BB0.16(B2) rg_BB0.16(B2) rg_BB1.16(B2) rg_BB2.16(B2) rg_BB3.16(B2) rg_BB4.16(B2) rg_BB5.16(B2) rg_BB6.16(B2) rg_BB7.16(B2) ; also on sheet 5 11 13 14
B3: pc_BB0.15(B3) pc_BB1.15(B3) pg_BB0.15(B3) rg_BB0.15(B3) rg_BB1.15(B3) rg_BB2.15(B3) rg_BB3.15(B3) rg_BB4.15(B3) rg_BB5.15(B3) rg_BB6.15(B3) rg_BB7.15(B3) ; also on sheet 5 11 13 14
B4: pc_BB0.14(B4) pc_BB1.14(B4) pg_BB0.14(B4) rg_BB0.14(B4) rg_BB1.14(B4) rg_BB2.14(B4) rg_BB3.14(B4) rg_BB4.14(B4) rg_BB5.14(B4) rg_BB6.14(B4) rg_BB7.14(B4) ; also on sheet 5 11 13 14
B5: pc_BB0.13(B5) pc_BB1.13(B5) pg_BB0.13(B5) rg_BB0.13(B5) rg_BB1.13(B5) rg_BB2.13(B5) rg_BB3.13(B5) rg_BB4.13(B5) rg_BB5.13(B5) rg_BB6.13(B5) rg_BB7.13(B5) ; also on sheet 5 11 13 14
B6: pc_BB0.12(B6) pc_BB1.12(B6) pg_BB0.12(B6) rg_BB0.12(B6) rg_BB1.12(B6) rg_BB2.12(B6) rg_BB3.12(B6) rg_BB4.12(B6) rg_BB5.12(B6) rg_BB6.12(B6) rg_BB7.12(B6) ; also on sheet 5 11 13 14
B7: pc_BB0.11(B7) pc_BB1.11(B7) pg_BB0.11(B7) rg_BB0.11(B7) rg_BB1.11(B7) rg_BB2.11(B7) rg_BB3.11(B7) rg_BB4.11(B7) rg_BB5.11(B7) rg_BB6.11(B7) rg_BB7.11(B7) ; also on sheet 5 11 13 14
BUF_MODEA: rg_U2.9(4A) ; also on sheet 5
BUF_MODEB: rg_U2.11(5A) ; also on sheet 5
C0: cd_OR1.1(1A) rg_BC0.18(B0) rg_BC1.18(B0) rg_BC2.18(B0) rg_BC3.18(B0) rg_BC4.18(B0) rg_BC5.18(B0) rg_BC6.18(B0) rg_BC7.18(B0)
C1: cd_OR1.2(1B) rg_BC0.17(B1) rg_BC1.17(B1) rg_BC2.17(B1) rg_BC3.17(B1) rg_BC4.17(B1) rg_BC5.17(B1) rg_BC6.17(B1) rg_BC7.17(B1)
C2: cd_OR1.4(2A) rg_BC0.16(B2) rg_BC1.16(B2) rg_BC2.16(B2) rg_BC3.16(B2) rg_BC4.16(B2) rg_BC5.16(B2) rg_BC6.16(B2) rg_BC7.16(B2)
C3: cd_OR1.5(2B) rg_BC0.15(B3) rg_BC1.15(B3) rg_BC2.15(B3) rg_BC3.15(B3) rg_BC4.15(B3) rg_BC5.15(B3) rg_BC6.15(B3) rg_BC7.15(B3)
C4: cd_OR2.1(1A) rg_BC0.14(B4) rg_BC1.14(B4) rg_BC2.14(B4) rg_BC3.14(B4) rg_BC4.14(B4) rg_BC5.14(B4) rg_BC6.14(B4) rg_BC7.14(B4)
C5: cd_OR2.2(1B) rg_BC0.13(B5) rg_BC1.13(B5) rg_BC2.13(B5) rg_BC3.13(B5) rg_BC4.13(B5) rg_BC5.13(B5) rg_BC6.13(B5) rg_BC7.13(B5)
C6: cd_OR2.4(2A) rg_BC0.12(B6) rg_BC1.12(B6) rg_BC2.12(B6) rg_BC3.12(B6) rg_BC4.12(B6) rg_BC5.12(B6) rg_BC6.12(B6) rg_BC7.12(B6)
C7: cd_MUX1.15(I4) cd_NOT1.3(2A) cd_OR2.5(2B) rg_BC0.11(B7) rg_BC1.11(B7) rg_BC2.11(B7) rg_BC3.11(B7) rg_BC4.11(B7) rg_BC5.11(B7) rg_BC6.11(B7) rg_BC7.11(B7)
CD_INPUT_NE: cd_AND1.2(IN 2A) cd_MUX1.1(I3) cd_NOT1.1(1A) cd_OR1.8(3Y)
CD_RES: cd_MUX1.5(Y) ; also on sheet 5
FREEZE_WRD: pc_D2.11(CP) pc_D3.11(CP) ; also on sheet 5 8 16
MODE: pc_U6.2(IN 2A) pc_U6.6(IN 2B) ; also on sheet 7 8 16
NOT_CD_RES: cd_MUX1.6(Y#) ; also on sheet 5
NOT_OP4: cd_NOT1.12(6Y) ; also on sheet 9
NOT_OPCD_11111: cd_AND1.12(IN 1D) ; also on sheet 8 9
NOT_PAGE_SET: pg_U1.1(1A) rg_DCSET.11(Y10#)
NOT_PC_MODE_SOURCE_INC: pc_D2.1(OE#) pc_D3.1(OE#) pc_U5.2(1Y) pc_U6.5(IN 1B)
NOT_PC_MODE_SOURCE_OUT: pc_BOUT0.19(OE#) pc_BOUT1.19(OE#) pc_U5.4(2Y) ; also on sheet 5
NOT_PC_SET: pc_U5.5(3A) rg_DCSET.9(Y8#)
OP4: cd_NOT1.13(6A) ; also on sheet 5 9
OP_CD0: cd_MUX1.11(S0) ; also on sheet 5
OP_CD1: cd_MUX1.10(S1) ; also on sheet 5
OP_CD2: cd_MUX1.9(S2) ; also on sheet 5
OUT0: pc_BOUT0.2(A0) rg_D0.2(D0) rg_D1.2(D0) rg_D2.2(D0) rg_D3.2(D0) rg_D4.2(D0) rg_D5.2(D0) rg_D6.2(D0) rg_D7.2(D0) ; also on sheet 6
OUT1: pc_BOUT0.3(A1) rg_D0.3(D1) rg_D1.3(D1) rg_D2.3(D1) rg_D3.3(D1) rg_D4.3(D1) rg_D5.3(D1) rg_D6.3(D1) rg_D7.3(D1) ; also on sheet 6
OUT2: pc_BOUT0.4(A2) rg_D0.4(D2) rg_D1.4(D2) rg_D2.4(D2) rg_D3.4(D2) rg_D4.4(D2) rg_D5.4(D2) rg_D6.4(D2) rg_D7.4(D2) ; also on sheet 6
OUT3: pc_BOUT0.5(A3) rg_D0.5(D3) rg_D1.5(D3) rg_D2.5(D3) rg_D3.5(D3) rg_D4.5(D3) rg_D5.5(D3) rg_D6.5(D3) rg_D7.5(D3) ; also on sheet 6
OUT4: pc_BOUT0.6(A4) rg_D0.6(D4) rg_D1.6(D4) rg_D2.6(D4) rg_D3.6(D4) rg_D4.6(D4) rg_D5.6(D4) rg_D6.6(D4) rg_D7.6(D4) ; also on sheet 6
OUT5: pc_BOUT0.7(A5) rg_D0.7(D5) rg_D1.7(D5) rg_D2.7(D5) rg_D3.7(D5) rg_D4.7(D5) rg_D5.7(D5) rg_D6.7(D5) rg_D7.7(D5) ; also on sheet 6
OUT6: pc_BOUT0.8(A6) rg_D0.8(D6) rg_D1.8(D6) rg_D2.8(D6) rg_D3.8(D6) rg_D4.8(D6) rg_D5.8(D6) rg_D6.8(D6) rg_D7.8(D6) ; also on sheet 6
OUT7: pc_BOUT0.9(A7) rg_D0.9(D7) rg_D1.9(D7) rg_D2.9(D7) rg_D3.9(D7) rg_D4.9(D7) rg_D5.9(D7) rg_D6.9(D7) rg_D7.9(D7) ; also on sheet 6
OUT8: pc_BOUT1.2(A0) pg_D0.2(D0) ; also on sheet 6
OUT9: pc_BOUT1.3(A1) pg_D0.3(D1) ; also on sheet 6
OUT10: pc_BOUT1.4(A2) pg_D0.4(D2) ; also on sheet 6
OUT11: pc_BOUT1.5(A3) pg_D0.5(D3) ; also on sheet 6
OUT12: pc_BOUT1.6(A4) pg_D0.6(D4) ; also on sheet 6
OUT13: pc_BOUT1.7(A5) pg_D0.7(D5) ; also on sheet 6
OUT14: pc_BOUT1.8(A6) pg_D0.8(D6) ; also on sheet 6
OUT15: pc_BOUT1.9(A7) pg_D0.9(D7) ; also on sheet 6
PAGE0: pg_BA0.2(A0) pg_BB0.2(A0) pg_D0.19(Q0) ; also on sheet 5
PAGE1: pg_BA0.3(A1) pg_BB0.3(A1) pg_D0.18(Q1) ; also on sheet 5
PAGE2: pg_BA0.4(A2) pg_BB0.4(A2) pg_D0.17(Q2) ; also on sheet 5
PAGE3: pg_BA0.5(A3) pg_BB0.5(A3) pg_D0.16(Q3) ; also on sheet 5
PAGE4: pg_BA0.6(A4) pg_BB0.6(A4) pg_D0.15(Q4) ; also on sheet 5
PAGE5: pg_BA0.7(A5) pg_BB0.7(A5) pg_D0.14(Q5) ; also on sheet 5
PAGE6: pg_BA0.8(A6) pg_BB0.8(A6) pg_D0.13(Q6) ; also on sheet 5
PAGE7: pg_BA0.9(A7) pg_BB0.9(A7) pg_D0.12(Q7) ; also on sheet 5
PAGE_WRITEA: pg_BA0.19(OE#) rg_DCA.13(Y11#)
PAGE_WRITEB: pg_BB0.19(OE#) rg_DCB.13(Y11#)
PC0_WRITEA: pc_BA0.19(OE#) rg_DCA.9(Y8#)
PC0_WRITEB: pc_BB0.19(OE#) rg_DCB.9(Y8#)
PC1_WRITEA: pc_BA1.19(OE#) rg_DCA.10(Y9#)
PC1_WRITEB: pc_BB1.19(OE#) rg_DCB.10(Y9#)
PC_B0: pc_BA0.2(A0) pc_BB0.2(A0) pc_D0.19(Q0) pc_U1.5(A1) ; also on sheet 5 16
PC_B1: pc_BA0.3(A1) pc_BB0.3(A1) pc_D0.18(Q1) pc_U1.3(A2) ; also on sheet 5 16
PC_B2: pc_BA0.4(A2) pc_BB0.4(A2) pc_D0.17(Q2) pc_U1.14(A3) ; also on sheet 5 16
PC_B3: pc_BA0.5(A3) pc_BB0.5(A3) pc_D0.16(Q3) pc_U1.12(A4) ; also on sheet 5 16
PC_B4: pc_BA0.6(A4) pc_BB0.6(A4) pc_D0.15(Q4) pc_U2.5(A1) ; also on sheet 5 16
PC_B5: pc_BA0.7(A5) pc_BB0.7(A5) pc_D0.14(Q5) pc_U2.3(A2) ; also on sheet 5 16
PC_B6: pc_BA0.8(A6) pc_BB0.8(A6) pc_D0.13(Q6) pc_U2.14(A3) ; also on sheet 5 16
PC_B7: pc_BA0.9(A7) pc_BB0.9(A7) pc_D0.12(Q7) pc_U2.12(A4) ; also on sheet 5 16
PC_B8: pc_BA1.2(A0) pc_BB1.2(A0) pc_D1.19(Q0) pc_U3.5(A1) ; also on sheet 5 16
PC_B9: pc_BA1.3(A1) pc_BB1.3(A1) pc_D1.18(Q1) pc_U3.3(A2) ; also on sheet 5 16
PC_B10: pc_BA1.4(A2) pc_BB1.4(A2) pc_D1.17(Q2) pc_U3.14(A3) ; also on sheet 5 16
PC_B11: pc_BA1.5(A3) pc_BB1.5(A3) pc_D1.16(Q3) pc_U3.12(A4) ; also on sheet 5 16
PC_B12: pc_BA1.6(A4) pc_BB1.6(A4) pc_D1.15(Q4) pc_U4.5(A1) ; also on sheet 5 16
PC_B13: pc_BA1.7(A5) pc_BB1.7(A5) pc_D1.14(Q5) pc_U4.3(A2) ; also on sheet 5 16
PC_B14: pc_BA1.8(A6) pc_BB1.8(A6) pc_D1.13(Q6) pc_U4.14(A3) ; also on sheet 5 16
PC_B15: pc_BA1.9(A7) pc_BB1.9(A7) pc_D1.12(Q7) pc_U4.12(A4) ; also on sheet 5 16
PC_IN0: pc_BOUT0.18(B0) pc_D0.2(D0) pc_D2.19(Q0) R1.1
PC_IN1: pc_BOUT0.17(B1) pc_D0.3(D1) pc_D2.18(Q1) R2.1
PC_IN2: pc_BOUT0.16(B2) pc_D0.4(D2) pc_D2.17(Q2) R3.1
PC_IN3: pc_BOUT0.15(B3) pc_D0.5(D3) pc_D2.16(Q3) R4.1
PC_IN4: pc_BOUT0.14(B4) pc_D0.6(D4) pc_D2.15(Q4) R5.1
PC_IN5: pc_BOUT0.13(B5) pc_D0.7(D5) pc_D2.14(Q5) R6.1
PC_IN6: pc_BOUT0.12(B6) pc_D0.8(D6) pc_D2.13(Q6) R7.1
PC_IN7: pc_BOUT0.11(B7) pc_D0.9(D7) pc_D2.12(Q7) R8.1
PC_IN8: pc_BOUT1.18(B0) pc_D1.2(D0) pc_D3.19(Q0) R9.1
PC_IN9: pc_BOUT1.17(B1) pc_D1.3(D1) pc_D3.18(Q1) R10.1
PC_IN10: pc_BOUT1.16(B2) pc_D1.4(D2) pc_D3.17(Q2) R11.1
PC_IN11: pc_BOUT1.15(B3) pc_D1.5(D3) pc_D3.16(Q3) R12.1
PC_IN12: pc_BOUT1.14(B4) pc_D1.6(D4) pc_D3.15(Q4) R13.1
PC_IN13: pc_BOUT1.13(B5) pc_D1.7(D5) pc_D3.14(Q5) R14.1
PC_IN14: pc_BOUT1.12(B6) pc_D1.8(D6) pc_D3.13(Q6) R15.1
PC_IN15: pc_BOUT1.11(B7) pc_D1.9(D7) pc_D3.12(Q7) R16.1
PC_INC0: pc_D2.2(D0) pc_U1.4(S1)
PC_INC1: pc_D2.3(D1) pc_U1.1(S2)
PC_INC2: pc_D2.4(D2) pc_U1.13(S3)
PC_INC3: pc_D2.5(D3) pc_U1.10(S4)
PC_INC4: pc_D2.6(D4) pc_U2.4(S1)
PC_INC5: pc_D2.7(D5) pc_U2.1(S2)
PC_INC6: pc_D2.8(D6) pc_U2.13(S3)
PC_INC7: pc_D2.9(D7) pc_U2.10(S4)
PC_INC8: pc_D3.2(D0) pc_U3.4(S1)
PC_INC9: pc_D3.3(D1) pc_U3.1(S2)
PC_INC10: pc_D3.4(D2) pc_U3.13(S3)
PC_INC11: pc_D3.5(D3) pc_U3.10(S4)
PC_INC12: pc_D3.6(D4) pc_U4.4(S1)
PC_INC13: pc_D3.7(D5) pc_U4.1(S2)
PC_INC14: pc_D3.8(D6) pc_U4.13(S3)
PC_INC15: pc_D3.9(D7) pc_U4.10(S4)
PC_MODE_SOURCE_OUT: pc_U5.3(2A) pc_U6.4(OUT B) ; also on sheet 5
PC_SET: pc_D0.11(CP) pc_D1.11(CP) pc_U5.6(3Y)
PC_SOURCE_INC: pc_U6.1(IN 1A) ; also on sheet 8 16
RG0_NOTSET: rg_DCSET.1(Y0#) rg_U1.1(1A)
RG0_SET: rg_D0.11(CP) rg_U1.2(1Y)
RG0_WRITEA: rg_BA0.19(OE#) rg_DCA.1(Y0#)
RG0_WRITEB: rg_BB0.19(OE#) rg_DCB.1(Y0#)
RG0_WRITEC: rg_BC0.19(OE#) rg_DCC.1(Y0#)
RG1_NOTSET: rg_DCSET.2(Y1#) rg_U1.3(2A)
RG1_SET: rg_D1.11(CP) rg_U1.4(2Y)
RG1_WRITEA: rg_BA1.19(OE#) rg_DCA.2(Y1#)
RG1_WRITEB: rg_BB1.19(OE#) rg_DCB.2(Y1#)
RG1_WRITEC: rg_BC1.19(OE#) rg_DCC.2(Y1#)
RG2_NOTSET: rg_DCSET.3(Y2#) rg_U1.5(3A)
RG2_SET: rg_D2.11(CP) rg_U1.6(3Y)
RG2_WRITEA: rg_BA2.19(OE#) rg_DCA.3(Y2#)
RG2_WRITEB: rg_BB2.19(OE#) rg_DCB.3(Y2#)
RG2_WRITEC: rg_BC2.19(OE#) rg_DCC.3(Y2#)
RG3_NOTSET: rg_DCSET.4(Y3#) rg_U1.9(4A)
RG3_SET: rg_D3.11(CP) rg_U1.8(4Y)
RG3_WRITEA: rg_BA3.19(OE#) rg_DCA.4(Y3#)
RG3_WRITEB: rg_BB3.19(OE#) rg_DCB.4(Y3#)
RG3_WRITEC: rg_BC3.19(OE#) rg_DCC.4(Y3#)
RG4_NOTSET: rg_DCSET.5(Y4#) rg_U1.11(5A)
RG4_SET: rg_D4.11(CP) rg_U1.10(5Y)
RG4_WRITEA: rg_BA4.19(OE#) rg_DCA.5(Y4#)
RG4_WRITEB: rg_BB4.19(OE#) rg_DCB.5(Y4#)
RG4_WRITEC: rg_BC4.19(OE#) rg_DCC.5(Y4#)
RG5_NOTSET: rg_DCSET.6(Y5#) rg_U1.13(6A)
RG5_SET: rg_D5.11(CP) rg_U1.12(6Y)
RG5_WRITEA: rg_BA5.19(OE#) rg_DCA.6(Y5#)
RG5_WRITEB: rg_BB5.19(OE#) rg_DCB.6(Y5#)
RG5_WRITEC: rg_BC5.19(OE#) rg_DCC.6(Y5#)
RG6_NOTSET: rg_DCSET.7(Y6#) rg_U2.3(2A)
RG6_SET: rg_D6.11(CP) rg_U2.4(2Y)
RG6_WRITEA: rg_BA6.19(OE#) rg_DCA.7(Y6#)
RG6_WRITEB: rg_BB6.19(OE#) rg_DCB.7(Y6#)
RG6_WRITEC: rg_BC6.19(OE#) rg_DCC.7(Y6#)
RG7_NOTSET: rg_DCSET.8(Y7#) rg_U2.5(3A)
RG7_SET: rg_D7.11(CP) rg_U2.6(3Y)
RG7_WRITEA: rg_BA7.19(OE#) rg_DCA.8(Y7#)
RG7_WRITEB: rg_BB7.19(OE#) rg_DCB.8(Y7#)
RG7_WRITEC: rg_BC7.19(OE#) rg_DCC.8(Y7#)
STORE_WITH_BREAK: cd_AND1.11(OUT D) cd_OR2.10(3B) ; also on sheet 14
STORE_WITHOUT_BREAK: cd_AND1.13(IN 2D) ; also on sheet 9
$3N32152: rg_BA0.2(A0) rg_BB0.2(A0) rg_BC0.2(A0) rg_D0.19(Q0)
$3N32156: rg_BA0.3(A1) rg_BB0.3(A1) rg_BC0.3(A1) rg_D0.18(Q1)
$3N32160: rg_BA0.4(A2) rg_BB0.4(A2) rg_BC0.4(A2) rg_D0.17(Q2)
$3N32164: rg_BA0.5(A3) rg_BB0.5(A3) rg_BC0.5(A3) rg_D0.16(Q3)
$3N32168: rg_BA0.6(A4) rg_BB0.6(A4) rg_BC0.6(A4) rg_D0.15(Q4)
$3N32172: rg_BA0.7(A5) rg_BB0.7(A5) rg_BC0.7(A5) rg_D0.14(Q5)
$3N32176: rg_BA0.8(A6) rg_BB0.8(A6) rg_BC0.8(A6) rg_D0.13(Q6)
$3N32180: rg_BA0.9(A7) rg_BB0.9(A7) rg_BC0.9(A7) rg_D0.12(Q7)
$3N34941: rg_BA1.2(A0) rg_BB1.2(A0) rg_BC1.2(A0) rg_D1.19(Q0)
$3N34952: rg_BA1.3(A1) rg_BB1.3(A1) rg_BC1.3(A1) rg_D1.18(Q1)
$3N34963: rg_BA1.4(A2) rg_BB1.4(A2) rg_BC1.4(A2) rg_D1.17(Q2)
$3N34974: rg_BA1.5(A3) rg_BB1.5(A3) rg_BC1.5(A3) rg_D1.16(Q3)
$3N34985: rg_BA1.6(A4) rg_BB1.6(A4) rg_BC1.6(A4) rg_D1.15(Q4)
$3N34996: rg_BA1.7(A5) rg_BB1.7(A5) rg_BC1.7(A5) rg_D1.14(Q5)
$3N35007: rg_BA1.8(A6) rg_BB1.8(A6) rg_BC1.8(A6) rg_D1.13(Q6)
$3N35028: rg_BA1.9(A7) rg_BB1.9(A7) rg_BC1.9(A7) rg_D1.12(Q7)
$3N35770: rg_BA2.2(A0) rg_BB2.2(A0) rg_BC2.2(A0) rg_D2.19(Q0)
$3N35781: rg_BA2.3(A1) rg_BB2.3(A1) rg_BC2.3(A1) rg_D2.18(Q1)
$3N35792: rg_BA2.4(A2) rg_BB2.4(A2) rg_BC2.4(A2) rg_D2.17(Q2)
$3N35803: rg_BA2.5(A3) rg_BB2.5(A3) rg_BC2.5(A3) rg_D2.16(Q3)
$3N35814: rg_BA2.6(A4) rg_BB2.6(A4) rg_BC2.6(A4) rg_D2.15(Q4)
$3N35825: rg_BA2.7(A5) rg_BB2.7(A5) rg_BC2.7(A5) rg_D2.14(Q5)
$3N35836: rg_BA2.8(A6) rg_BB2.8(A6) rg_BC2.8(A6) rg_D2.13(Q6)
$3N35857: rg_BA2.9(A7) rg_BB2.9(A7) rg_BC2.9(A7) rg_D2.12(Q7)
$3N37420: rg_BA3.2(A0) rg_BB3.2(A0) rg_BC3.2(A0) rg_D3.19(Q0)
$3N37431: rg_BA3.3(A1) rg_BB3.3(A1) rg_BC3.3(A1) rg_D3.18(Q1)
$3N37442: rg_BA3.4(A2) rg_BB3.4(A2) rg_BC3.4(A2) rg_D3.17(Q2)
$3N37453: rg_BA3.5(A3) rg_BB3.5(A3) rg_BC3.5(A3) rg_D3.16(Q3)
$3N37464: rg_BA3.6(A4) rg_BB3.6(A4) rg_BC3.6(A4) rg_D3.15(Q4)
$3N37475: rg_BA3.7(A5) rg_BB3.7(A5) rg_BC3.7(A5) rg_D3.14(Q5)
$3N37486: rg_BA3.8(A6) rg_BB3.8(A6) rg_BC3.8(A6) rg_D3.13(Q6)
$3N37507: rg_BA3.9(A7) rg_BB3.9(A7) rg_BC3.9(A7) rg_D3.12(Q7)
$3N38249: rg_BA4.2(A0) rg_BB4.2(A0) rg_BC4.2(A0) rg_D4.19(Q0)
$3N38260: rg_BA4.3(A1) rg_BB4.3(A1) rg_BC4.3(A1) rg_D4.18(Q1)
$3N38271: rg_BA4.4(A2) rg_BB4.4(A2) rg_BC4.4(A2) rg_D4.17(Q2)
$3N38282: rg_BA4.5(A3) rg_BB4.5(A3) rg_BC4.5(A3) rg_D4.16(Q3)
$3N38293: rg_BA4.6(A4) rg_BB4.6(A4) rg_BC4.6(A4) rg_D4.15(Q4)
$3N38304: rg_BA4.7(A5) rg_BB4.7(A5) rg_BC4.7(A5) rg_D4.14(Q5)
$3N38315: rg_BA4.8(A6) rg_BB4.8(A6) rg_BC4.8(A6) rg_D4.13(Q6)
$3N38336: rg_BA4.9(A7) rg_BB4.9(A7) rg_BC4.9(A7) rg_D4.12(Q7)
$3N39078: rg_BA5.2(A0) rg_BB5.2(A0) rg_BC5.2(A0) rg_D5.19(Q0)
$3N39089: rg_BA5.3(A1) rg_BB5.3(A1) rg_BC5.3(A1) rg_D5.18(Q1)
$3N39100: rg_BA5.4(A2) rg_BB5.4(A2) rg_BC5.4(A2) rg_D5.17(Q2)
$3N39111: rg_BA5.5(A3) rg_BB5.5(A3) rg_BC5.5(A3) rg_D5.16(Q3)
$3N39122: rg_BA5.6(A4) rg_BB5.6(A4) rg_BC5.6(A4) rg_D5.15(Q4)
$3N39133: rg_BA5.7(A5) rg_BB5.7(A5) rg_BC5.7(A5) rg_D5.14(Q5)
$3N39144: rg_BA5.8(A6) rg_BB5.8(A6) rg_BC5.8(A6) rg_D5.13(Q6)
$3N39165: rg_BA5.9(A7) rg_BB5.9(A7) rg_BC5.9(A7) rg_D5.12(Q7)
$3N39907: rg_BA6.2(A0) rg_BB6.2(A0) rg_BC6.2(A0) rg_D6.19(Q0)
$3N39918: rg_BA6.3(A1) rg_BB6.3(A1) rg_BC6.3(A1) rg_D6.18(Q1)
$3N39929: rg_BA6.4(A2) rg_BB6.4(A2) rg_BC6.4(A2) rg_D6.17(Q2)
$3N39940: rg_BA6.5(A3) rg_BB6.5(A3) rg_BC6.5(A3) rg_D6.16(Q3)
$3N39951: rg_BA6.6(A4) rg_BB6.6(A4) rg_BC6.6(A4) rg_D6.15(Q4)
$3N39962: rg_BA6.7(A5) rg_BB6.7(A5) rg_BC6.7(A5) rg_D6.14(Q5)
$3N39973: rg_BA6.8(A6) rg_BB6.8(A6) rg_BC6.8(A6) rg_D6.13(Q6)
$3N39994: rg_BA6.9(A7) rg_BB6.9(A7) rg_BC6.9(A7) rg_D6.12(Q7)
$3N40736: rg_BA7.2(A0) rg_BB7.2(A0) rg_BC7.2(A0) rg_D7.19(Q0)
$3N40747: rg_BA7.3(A1) rg_BB7.3(A1) rg_BC7.3(A1) rg_D7.18(Q1)
$3N40758: rg_BA7.4(A2) rg_BB7.4(A2) rg_BC7.4(A2) rg_D7.17(Q2)
$3N40769: rg_BA7.5(A3) rg_BB7.5(A3) rg_BC7.5(A3) rg_D7.16(Q3)
$3N40780: rg_BA7.6(A4) rg_BB7.6(A4) rg_BC7.6(A4) rg_D7.15(Q4)
$3N40791: rg_BA7.7(A5) rg_BB7.7(A5) rg_BC7.7(A5) rg_D7.14(Q5)
$3N40802: rg_BA7.8(A6) rg_BB7.8(A6) rg_BC7.8(A6) rg_D7.13(Q6)
$3N40823: rg_BA7.9(A7) rg_BB7.9(A7) rg_BC7.9(A7) rg_D7.12(Q7)
$4N4413: pc_U1.9(COUT) pc_U2.7(CIN)
$4N4455: pc_U2.9(COUT) pc_U3.7(CIN)
$4N4461: pc_U3.9(COUT) pc_U4.7(CIN)
$4N9047: pc_U5.1(1A) pc_U6.3(OUT A)
$5N582: cd_OR1.3(1Y) cd_OR1.13(4B)
$5N593: cd_OR1.6(2Y) cd_OR1.12(4A)
$5N762: cd_OR2.3(1Y) cd_OR2.13(4B)
$5N768: cd_OR2.6(2Y) cd_OR2.12(4A)
$5N778: cd_OR1.10(3B) cd_OR1.11(4Y)
$5N808: cd_OR1.9(3A) cd_OR2.11(4Y)
$5N1007: cd_MUX1.2(I2) cd_NOT1.2(1Y)
$5N1018: cd_AND1.1(IN 1A) cd_MUX1.14(I5) cd_NOT1.4(2Y)
$5N1813: cd_AND1.3(OUT A) cd_MUX1.13(I6) cd_NOT1.9(4A)
$5N1831: cd_MUX1.12(I7) cd_NOT1.8(4Y)
$6N751: pg_D0.11(CP) pg_U1.2(1Y)

Not connected (* = marked no-connect by the designer): cd_AND1 4(OUT B)* 5(IN 1B)* 6(IN 2B)* 8(IN 1C)* 9(IN 2C)* 10(OUT C)*; cd_NOT1 5(3A)* 6(3Y)* 10(5Y)* 11(5A)*; pc_U4 9(COUT)*; pc_U5 8(4Y)* 9(4A)* 10(5Y)* 11(5A)* 12(6Y)* 13(6A)*; pc_U6 8(IN 1C)* 9(IN 2C)* 10(OUT C)* 11(OUT D)* 12(IN 1D)* 13(IN 2D)*; pg_U1 3(2A)* 4(2Y)* 5(3A)* 6(3Y)* 8(4Y)* 9(4A)* 10(5Y)* 11(5A)* 12(6Y)* 13(6A)*; rg_DCA 11(Y10#)* 14(Y12#)* 15(Y13#)* 16(Y14#)* 17(Y15#)*; rg_DCB 11(Y10#)* 14(Y12#)* 15(Y13#)* 16(Y14#)* 17(Y15#)*; rg_DCC 9(Y8#)* 10(Y9#)* 11(Y10#)* 13(Y11#)* 14(Y12#)* 15(Y13#)* 16(Y14#)* 17(Y15#)*; rg_DCSET 10(Y9#)* 13(Y11#)* 14(Y12#)* 15(Y13#)* 16(Y14#)* 17(Y15#)*
